# Altium schematic sheet Audio-Out.SchDoc
size A3; Date: 27.05.2014; DrawnBy: luths8; Organization: BFH; Address1: Bern University of Applied Sciences; Address2: Engineering and Information Technology; Address3: Jlcoweg 1; Address4: CH-3400 Burgdorf; DocumentNumber: 1; Revision: 1.0; SheetNumber: 3; SheetTotal: 17; CurrentDate: 27.05.2014
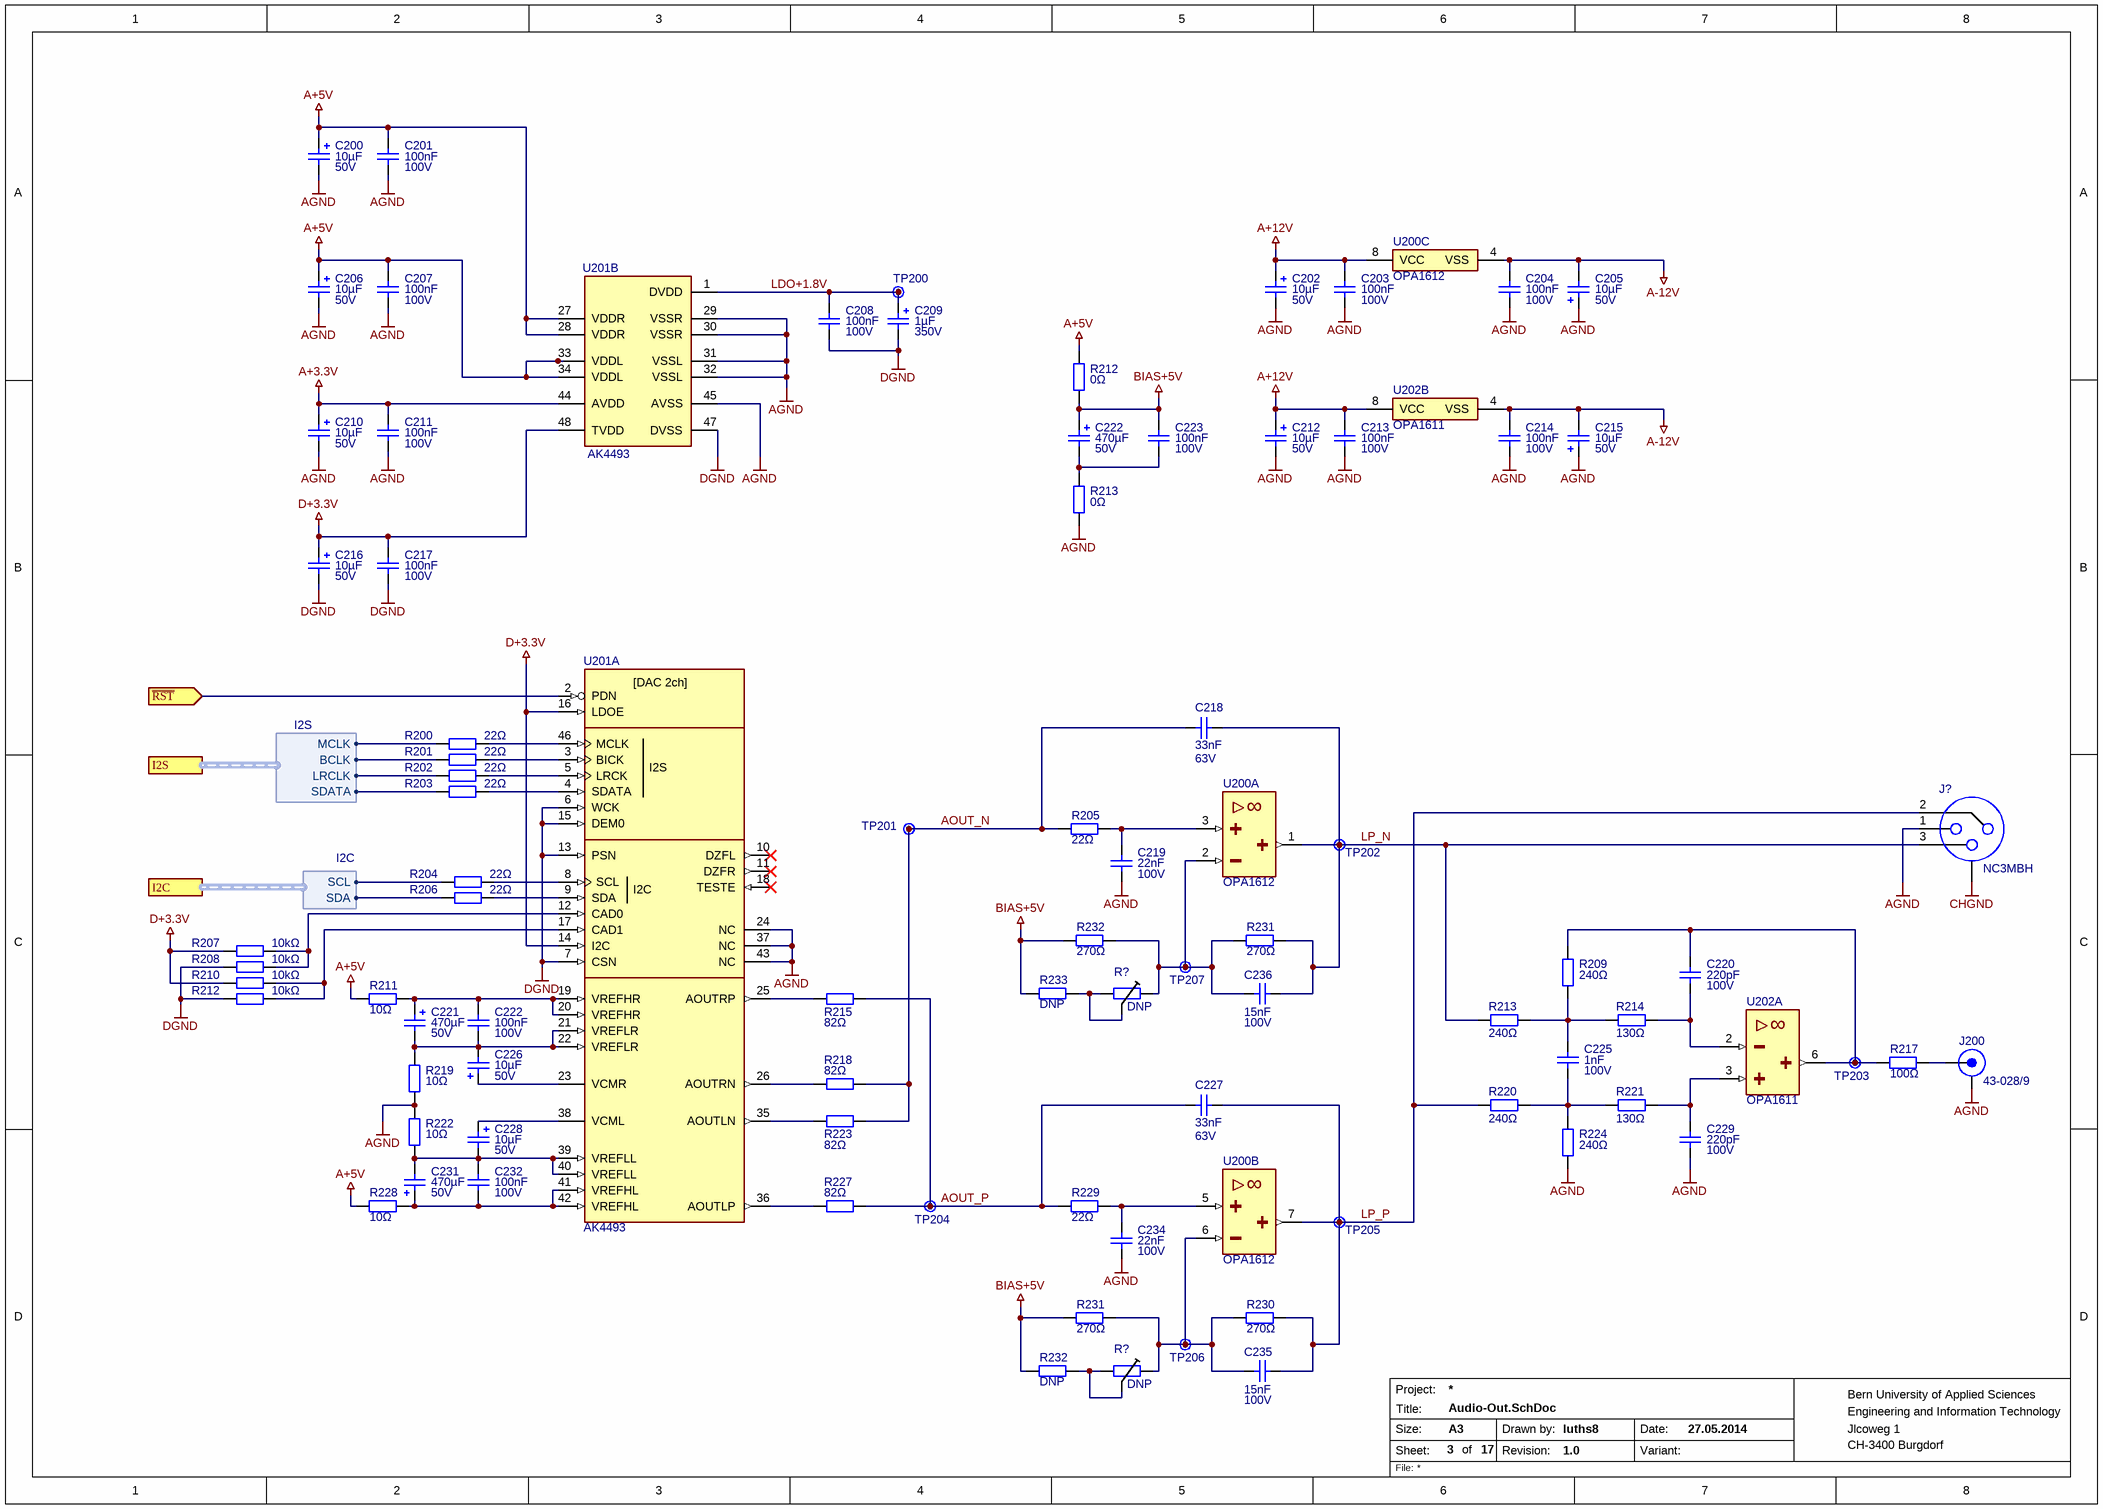
[diagram p0: Audio-Out.SchDoc]

## Parts
(Parts that share a designator on the sheet are numbered #1, #2 ... from top to bottom, then left to right.)
C200  10µF  Voltage: 50V  [CAP-5-11.5-2]
C201  100nF  Voltage: 100V  [CAP_WIMA_MKP4F]
C202  10µF  Voltage: 50V  [CAP-5-11.5-2]
C203  100nF  Voltage: 100V  [CAP_WIMA_MKP4F]
C204  100nF  Voltage: 100V  [CAP_WIMA_MKP4F]
C205  10µF  Voltage: 50V  [CAP-5-11.5-2]
C206  10µF  Voltage: 50V  [CAP-5-11.5-2]
C207  100nF  Voltage: 100V  [CAP_WIMA_MKP4F]
C208  100nF  Voltage: 100V  [CAP_WIMA_MKP4D]
C209  1µF  Voltage: 350V  [CAP-6.3-11.2-2.5]
C210  10µF  Voltage: 50V  [CAP-5-11.5-2]
C211  100nF  Voltage: 100V  [CAP_WIMA_MKP4F]
C212  10µF  Voltage: 50V  [CAP-5-11.5-2]
C213  100nF  Voltage: 100V  [CAP_WIMA_MKP4F]
C214  100nF  Voltage: 100V  [CAP_WIMA_MKP4F]
C215  10µF  Voltage: 50V  [CAP-5-11.5-2]
C216  10µF  Voltage: 50V  [CAP-5-11.5-2]
C217  100nF  Voltage: 100V  [CAP_WIMA_MKP4F]
C218  33nF  Voltage: 63V  [CAP_WIMA_FKP2C]
C219  22nF  Voltage: 100V  [CAP_WIMA_FKP2C]
C220  220pF  Voltage: 100V  [CAP_WIMA_FKP2D]
C221  470µF  Voltage: 50V  [CAP-12.5-20-5]
C222#1  470µF  Voltage: 50V  [CAP-12.5-20-5]
C222#2  100nF  Voltage: 100V  [CAP_WIMA_MKP4F]
C223  100nF  Voltage: 100V  [CAP_WIMA_MKP4F]
C225  1nF  Voltage: 100V  [CAP_WIMA_FKP2D]
C226  10µF  Voltage: 50V  [CAP-5-11.5-2]
C227  33nF  Voltage: 63V  [CAP_WIMA_FKP2C]
C228  10µF  Voltage: 50V  [CAP-5-11.5-2]
C229  220pF  Voltage: 100V  [CAP_WIMA_FKP2D]
C231  470µF  Voltage: 50V  [CAP-12.5-20-5]
C232  100nF  Voltage: 100V  [CAP_WIMA_MKP4F]
C234  22nF  Voltage: 100V  [CAP_WIMA_FKP2C]
C235  15nF  Voltage: 100V  [CAP_WIMA_FKP2C]
C236  15nF  Voltage: 100V  [CAP_WIMA_FKP2C]
J200  43-028/9  [RCA-Plug]
J?  NC3MBH  [NC3MBH]
R200  22Ω  [SMD0603RES]
R201  22Ω  [SMD0603RES]
R202  22Ω  [SMD0603RES]
R203  22Ω  [SMD0603RES]
R204  22Ω  [SMD0603RES]
R205  22Ω  [SMD0603RES]
R206  22Ω  [SMD0603RES]
R207  10kΩ  [SMD0603RES]
R208  10kΩ  [SMD0603RES]
R209  240Ω  [SMD0603RES]
R210  10kΩ  [SMD0603RES]
R211  10Ω  [SMD0603RES]
R212#1  0Ω  [SMD0603RES]
R212#2  10kΩ  [SMD0603RES]
R213#1  0Ω  [SMD0603RES]
R213#2  240Ω  [SMD0603RES]
R214  130Ω  [SMD0603RES]
R215  82Ω  [SMD0603RES]
R217  100Ω  [SMD0603RES]
R218  82Ω  [SMD0603RES]
R219  10Ω  [SMD0603RES]
R220  240Ω  [SMD0603RES]
R221  130Ω  [SMD0603RES]
R222  10Ω  [SMD0603RES]
R223  82Ω  [SMD0603RES]
R224  240Ω  [SMD0603RES]
R227  82Ω  [SMD0603RES]
R228  10Ω  [SMD0603RES]
R229  22Ω  [SMD0603RES]
R230  270Ω  [SMD0603RES]
R231#1  270Ω  [SMD0603RES]
R231#2  270Ω  [SMD0603RES]
R232#1  270Ω  [SMD0603RES]
R232#2  DNP  [SMD0603RES]
R233  DNP  [SMD0603RES]
R?#1  DNP  [3266]
R?#2  DNP  [3266]
TP200  Testpoint  [TP]  (value not drawn)  (no BOM)
TP201  Testpoint  [TP]  (value not drawn)  (no BOM)
TP202  Testpoint  [TP]  (value not drawn)  (no BOM)
TP203  Testpoint  [TP]  (value not drawn)  (no BOM)
TP204  Testpoint  [TP]  (value not drawn)  (no BOM)
TP205  Testpoint  [TP]  (value not drawn)  (no BOM)
TP206  Testpoint  [TP]  (value not drawn)  (no BOM)
TP207  Testpoint  [TP]  (value not drawn)  (no BOM)
U200  OPA1612  [SOIC8]  (parts A,B,C of 3)
U201  AK4493  [LQFP48]  (parts A,B of 2)
U202  OPA1611  [SOIC8]  (parts A,B of 2)

## Ports
I2C (harness I2C), I2S (harness I2S), ~{RST} (in)

## Harnesses
I2S: MCLK, BCLK, LRCLK, SDATA
I2C: SCL, SDA

## Nets
A+3.3V: C210.P C211.2(q) U201.44(AVDD)
A+5V: C200.P C201.2(q) C206.P C207.2(q) R211.2 R212#1.1 R228.1 U201.27(VDDR) U201.28(VDDR) U201.33(VDDL) U201.34(VDDL)
A+12V: C202.P C203.2(q) C212.P C213.2(q) U200.8(VCC) U202.8(VCC)
A-12V: C204.1 C205.M(q) C214.1 C215.M(q) U200.4(VSS) U202.4(VSS)
AGND: C200.M(q) C201.1 C202.M(q) C203.1 C204.2(q) C205.P C206.M(q) C207.1 C210.M(q) C211.1 C212.M(q) C213.1 C214.2(q) C215.P C219.1 C229.1 C234.1 J200.2 J?.1 R213#1.2 R219.2 R222.1 R224.1 U201.24(NC) U201.29(VSSR) U201.30(VSSR) U201.31(VSSL) U201.32(VSSL) U201.37(NC) U201.43(NC) U201.45(AVSS)
BIAS+5V: C222#1.P C223.2(q) R212#1.2 R231#2.2 R232#1.2 R232#2.2 R233.2
CHGND: J?.0
D+3.3V: C216.P C217.2(q) R207.2 R210.2 U201.14(I2C) U201.16(LDOE) U201.48(TVDD)
DGND: C208.1 C209.M(q) C216.M(q) C217.1 R208.2 R212#2.2 U201.6(WCK) U201.7(CSN) U201.13(PSN) U201.15(DEM0) U201.47(DVSS)
AOUT_N: C218.1 R205.2 R218.1 R223.1 TP201.1
AOUT_P: C227.1 R215.1 R227.1 R229.2 TP204.1
LDO+1.8V: C208.2(q) C209.P TP200.1 U201.1(DVDD)
LP_N: C218.2(q) C236.1 J?.3 R213#2.2 R231#1.1 TP202.1 U200.1(OUTA)
LP_P: C227.2(q) C235.1 J?.2 R220.2 R230.1 TP205.1 U200.7(OUTB)
~{RST}: U201.2(PDN) ; port ~{RST}
NetC219_2: C219.2(q) R205.1 U200.3(PINA)
NetC220_1: C220.1 R209.1 R217.2 TP203.1 U202.6(OUT)
NetC220_2: C220.2(q) R214.2 U202.2(NIN)
NetC221_M: C221.M(q) C222#2.1 C226.M(q) R219.1 U201.21(VREFLR) U201.22(VREFLR)
NetC221_P: C221.P C222#2.2(q) R211.1 U201.19(VREFHR) U201.20(VREFHR)
NetC222#1_M: C222#1.M(q) C223.1 R213#1.1
NetC225_1: C225.1 R209.2 R213#2.1 R214.1
NetC225_2: C225.2(q) R220.1 R221.1 R224.2
NetC226_P: C226.P U201.23(VCMR)
NetC228_M: C228.M(q) C231.M(q) C232.2(q) R222.2 U201.39(VREFLL) U201.40(VREFLL)
NetC228_P: C228.P U201.38(VCML)
NetC229_2: C229.2(q) R221.2 U202.3(PIN)
NetC231_P: C231.P C232.1 R228.2 U201.41(VREFHL) U201.42(VREFHL)
NetC234_2: C234.2(q) R229.1 U200.5(PINB)
NetC235_2: C235.2(q) R230.2 R231#2.1 R?#2.1 TP206.1 U200.6(NINB)
NetC236_2: C236.2(q) R231#1.2 R232#1.1 R?#1.1 TP207.1 U200.2(NINA)
NetJ200_1: J200.1 R217.1
NetR200_1: R200.1 U201.46(MCLK)
NetR200_2: R200.2 ; port I2S.MCLK
NetR201_1: R201.1 U201.3(BICK)
NetR201_2: R201.2 ; port I2S.BCLK
NetR202_1: R202.1 U201.5(LRCK)
NetR202_2: R202.2 ; port I2S.LRCLK
NetR203_1: R203.1 U201.4(SDATA)
NetR203_2: R203.2 ; port I2S.SDATA
NetR204_1: R204.1 U201.8(SCL)
NetR204_2: R204.2 ; port I2C.SCL
NetR206_1: R206.1 U201.9(SDA)
NetR206_2: R206.2 ; port I2C.SDA
NetR207_1: R207.1 R208.1 U201.12(CAD0)
NetR210_1: R210.1 R212#2.1 U201.17(CAD1)
NetR215_2: R215.2 U201.25(AOUTRP)
NetR218_2: R218.2 U201.26(AOUTRN)
NetR223_2: R223.2 U201.35(AOUTLN)
NetR227_2: R227.2 U201.36(AOUTLP)
NetR232#2_1: R232#2.1 R?#2.2 R?#2.3
NetR233_1: R233.1 R?#1.2 R?#1.3

Not connected (* = marked no-connect by the designer): U201 10(DZFL)* 11(DZFR)* 18(TESTE)*

## Notes on the sheet
- Project:
- Size:
- Sheet:
- Title:
- A3
- of
- Drawn by:
- Revision:
- Date:
- Variant:
- File:
- (in symbol AK4493, part A) [DAC 2ch]; I2S
- (in symbol OPA1611, part A) ∞
- (in symbol OPA1612, part A) ∞
- (in symbol OPA1612, part B) ∞

## Library data of the parts
C200 C202 C205 C206 C210 C212 C215 C216 C226 C228 = Capacitor Electrolytic: Elektrolytic Capacitor; Manufacturer Part No.: EEU-FR1H100
C201 C203 C204 C207 C208 C211 C213 C214 C217 C222#2 C223 C232 = Capacitor Ceramic: Ceramic Capacitor; Manufacturer Part No.: MKP2D031001F00KF00
C209 = Capacitor Electrolytic: Elektrolytic Capacitor; Supplier 1: Mouser; Supplier Part Number 1: 667-ECA-2VM010; Manufacturer Part No.: *
C218 C227 = Capacitor Ceramic: Ceramic Capacitor; Manufacturer Part No.: FKP2C023301L00HSSD
C219 C234 = Capacitor Ceramic: Ceramic Capacitor; Manufacturer Part No.: FKP2D022201L00HF00
C220 C229 = Capacitor Ceramic: Ceramic Capacitor; Manufacturer Part No.: FKP2D002201D00HA00
C221 C222#1 C231 = Capacitor Electrolytic: Elektrolytic Capacitor; Manufacturer Part No.: EEU-FR1H471
C225 = Capacitor Ceramic: Ceramic Capacitor; Manufacturer Part No.: FKP2D001001D00HSSD
C235 C236 = Capacitor Ceramic: Ceramic Capacitor; Manufacturer Part No.: FKP2D021501J00HSSD
J200 = Connector RCA: RCA Connector; Manufacturer Part No.: *
J? = Connector XLR: XLR Connector Male, Panel Mount; Manufacturer Part No.: *
R200-R211 R212#1 R212#2 R213#1 R213#2 R214 R215 R217-R224 R227-R230 R231#1 R231#2 R232#1 R232#2 R233 = Resistor: Manufacturer Part No.: *
R?#1 R?#2 = Resistor Trimmer: Trimmer (resistive)
U200 = OPA1612: SoundPlus Operational Amplifier; Manufacturer Part No.: OPA1612
U201 = AK4493: 32-Bit 2ch Audio DAC; Manufacturer Part No.: AK4493EQ
U202 = OPA1611: SoundPlus Operational Amplifier; Manufacturer Part No.: OPA1611
TP200-TP207 = Testpoint: Manufacturer Part No.: *